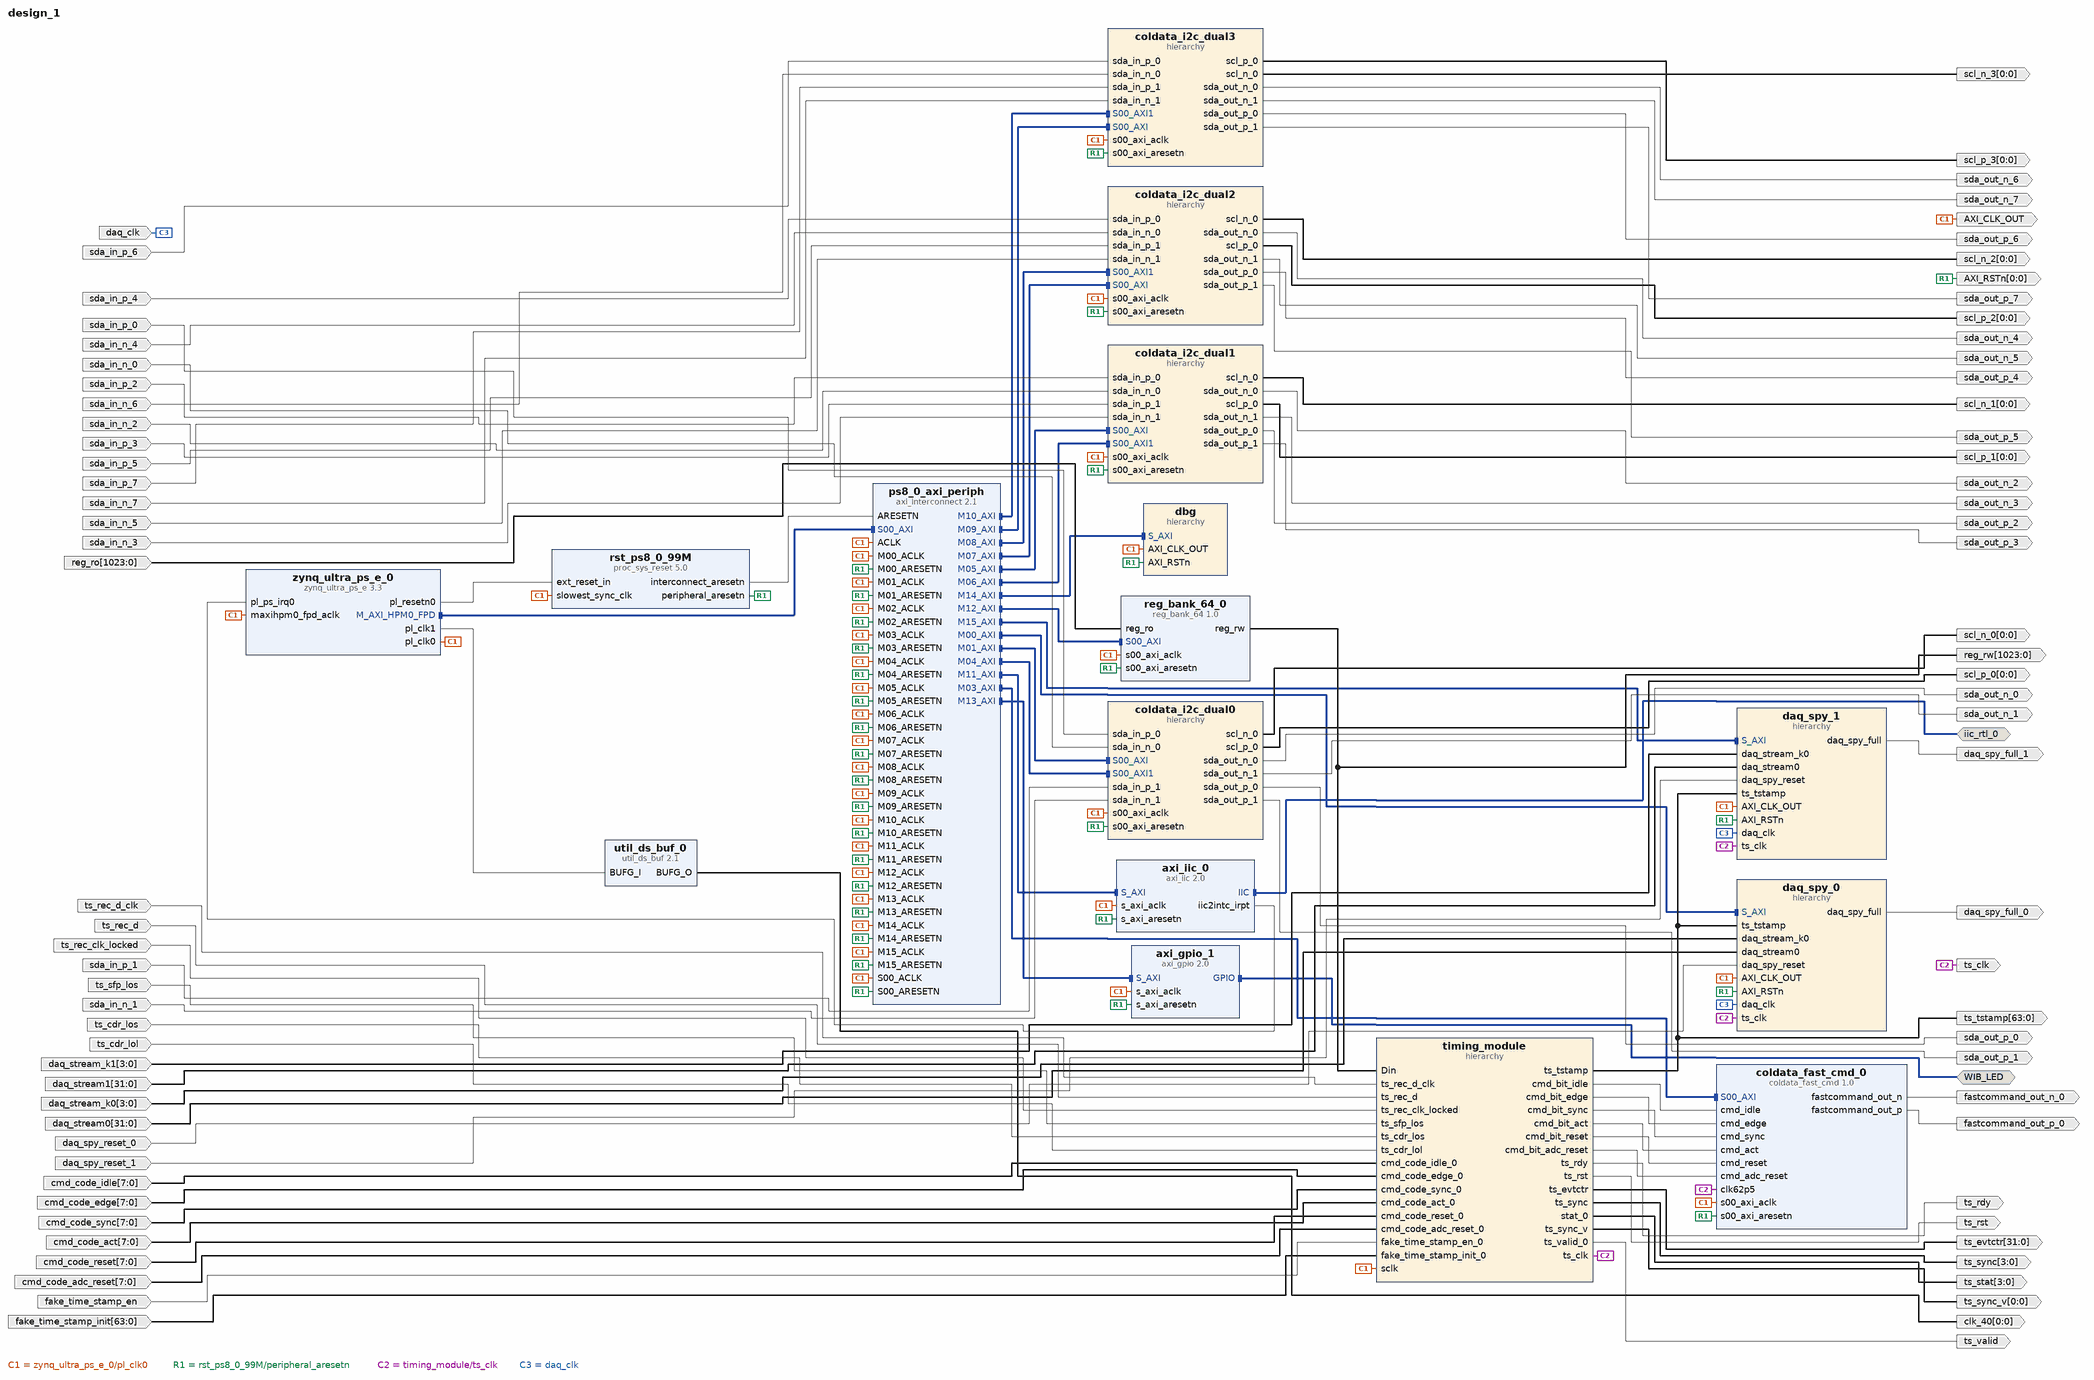
[diagram p0: block diagram of the top level]
# Vivado block design design_1, xczu9cg-ffvb1156-1-e, Vivado 2020.1.1_AR73018
create_bd_design design_1

create_bd_intf_port -mode Master -vlnv xilinx.com:interface:iic_rtl:1.0 iic_rtl_0
create_bd_intf_port -mode Master -vlnv xilinx.com:interface:gpio_rtl:1.0 WIB_LED
create_bd_port -dir O -from 0 -to 0 scl_p_0
create_bd_port -dir O -from 0 -to 0 scl_n_0
create_bd_port -dir O sda_out_p_0
create_bd_port -dir O sda_out_n_0
create_bd_port -dir I sda_in_p_0
create_bd_port -dir I sda_in_n_0
create_bd_port -dir O fastcommand_out_p_0
create_bd_port -dir O fastcommand_out_n_0
create_bd_port -dir I -type clk ts_rec_d_clk
set_property -dict {CONFIG.ASSOCIATED_RESET daq_spy_reset_0 CONFIG.FREQ_HZ 250000000} [get_bd_ports ts_rec_d_clk]
create_bd_port -dir I ts_rec_d
create_bd_port -dir I ts_rec_clk_locked
create_bd_port -dir I ts_sfp_los
create_bd_port -dir I ts_cdr_los
create_bd_port -dir I ts_cdr_lol
create_bd_port -dir O -type clk ts_clk
create_bd_port -dir O -type rst ts_rst
create_bd_port -dir O ts_rdy
create_bd_port -dir O -from 3 -to 0 ts_sync
create_bd_port -dir O -from 0 -to 0 ts_sync_v
create_bd_port -dir O -from 63 -to 0 ts_tstamp
create_bd_port -dir O -from 31 -to 0 ts_evtctr
create_bd_port -dir O sda_out_p_1
create_bd_port -dir O sda_out_n_1
create_bd_port -dir I sda_in_p_1
create_bd_port -dir I sda_in_n_1
create_bd_port -dir O sda_out_p_2
create_bd_port -dir O sda_out_n_2
create_bd_port -dir O sda_out_p_3
create_bd_port -dir O sda_out_n_3
create_bd_port -dir O sda_out_p_4
create_bd_port -dir O sda_out_n_4
create_bd_port -dir O sda_out_p_5
create_bd_port -dir O sda_out_n_5
create_bd_port -dir O sda_out_p_6
create_bd_port -dir O sda_out_n_6
create_bd_port -dir O sda_out_p_7
create_bd_port -dir O sda_out_n_7
create_bd_port -dir O -from 0 -to 0 scl_n_1
create_bd_port -dir O -from 0 -to 0 scl_p_1
create_bd_port -dir O -from 0 -to 0 scl_n_2
create_bd_port -dir O -from 0 -to 0 scl_p_2
create_bd_port -dir O -from 0 -to 0 scl_n_3
create_bd_port -dir O -from 0 -to 0 scl_p_3
create_bd_port -dir I sda_in_p_2
create_bd_port -dir I sda_in_n_2
create_bd_port -dir I sda_in_p_3
create_bd_port -dir I sda_in_n_3
create_bd_port -dir I sda_in_p_4
create_bd_port -dir I sda_in_n_4
create_bd_port -dir I sda_in_p_5
create_bd_port -dir I sda_in_n_5
create_bd_port -dir I sda_in_p_6
create_bd_port -dir I sda_in_n_6
create_bd_port -dir I sda_in_p_7
create_bd_port -dir I sda_in_n_7
create_bd_port -dir O -type clk AXI_CLK_OUT
create_bd_port -dir O -from 0 -to 0 -type rst AXI_RSTn
create_bd_port -dir I -from 1023 -to 0 reg_ro
create_bd_port -dir O -from 1023 -to 0 reg_rw
create_bd_port -dir I -from 3 -to 0 daq_stream_k1
create_bd_port -dir I -from 31 -to 0 daq_stream1
create_bd_port -dir I -from 3 -to 0 daq_stream_k0
create_bd_port -dir I -from 31 -to 0 daq_stream0
create_bd_port -dir I -type clk daq_clk
set_property -dict {CONFIG.ASSOCIATED_RESET daq_spy_reset_0:daq_spy_reset_1} [get_bd_ports daq_clk]
create_bd_port -dir I -type rst daq_spy_reset_0
set_property -dict {CONFIG.POLARITY ACTIVE_LOW} [get_bd_ports daq_spy_reset_0]
create_bd_port -dir O daq_spy_full_0
create_bd_port -dir I -type rst daq_spy_reset_1
create_bd_port -dir O daq_spy_full_1
create_bd_port -dir O -from 3 -to 0 ts_stat
create_bd_port -dir O ts_valid
create_bd_port -dir I -from 7 -to 0 cmd_code_idle
create_bd_port -dir I -from 7 -to 0 cmd_code_edge
create_bd_port -dir I -from 7 -to 0 cmd_code_sync
create_bd_port -dir I -from 7 -to 0 cmd_code_act
create_bd_port -dir I -from 7 -to 0 -type rst cmd_code_reset
create_bd_port -dir I -from 7 -to 0 -type rst cmd_code_adc_reset
create_bd_port -dir I fake_time_stamp_en
create_bd_port -dir I -from 63 -to 0 fake_time_stamp_init
create_bd_port -dir O -from 0 -to 0 -type clk clk_40
set_property -dict {CONFIG.FREQ_HZ 40000000} [get_bd_ports clk_40]

create_bd_cell -type hier timing_module
create_bd_cell -type hier coldata_i2c_dual0
create_bd_cell -type hier coldata_i2c_dual1
create_bd_cell -type hier coldata_i2c_dual2
create_bd_cell -type hier coldata_i2c_dual3
create_bd_cell -type hier dbg
create_bd_cell -type hier daq_spy_0
create_bd_cell -type hier daq_spy_1
create_bd_cell -type ip -vlnv xilinx.com:ip:axi_gpio:2.0 axi_gpio_1
set_property -dict [list \
  CONFIG.C_ALL_INPUTS 0 \
  CONFIG.C_ALL_OUTPUTS 1 \
  CONFIG.C_DOUT_DEFAULT 0x0000005a \
  CONFIG.GPIO_BOARD_INTERFACE Custom \
  CONFIG.USE_BOARD_FLOW true \
] [get_bd_cells axi_gpio_1]
create_bd_cell -type ip -vlnv xilinx.com:ip:axi_iic:2.0 axi_iic_0
set_property -dict {CONFIG.IIC_BOARD_INTERFACE Custom CONFIG.USE_BOARD_FLOW true} [get_bd_cells axi_iic_0]
create_bd_cell -type ip -vlnv user.org:user:coldata_fast_cmd:1.0 coldata_fast_cmd_0
create_bd_cell -type ip -vlnv xilinx.com:ip:axi_interconnect:2.1 ps8_0_axi_periph
set_property -dict {CONFIG.NUM_MI 16} [get_bd_cells ps8_0_axi_periph]
create_bd_cell -type ip -vlnv user.org:user:reg_bank_64:1.0 reg_bank_64_0
create_bd_cell -type ip -vlnv xilinx.com:ip:proc_sys_reset:5.0 rst_ps8_0_99M
create_bd_cell -type ip -vlnv xilinx.com:ip:zynq_ultra_ps_e:3.3 zynq_ultra_ps_e_0
set_property -dict [list \
  CONFIG.CAN0_BOARD_INTERFACE custom \
  CONFIG.CAN1_BOARD_INTERFACE custom \
  CONFIG.CSU_BOARD_INTERFACE custom \
  CONFIG.DP_BOARD_INTERFACE custom \
  CONFIG.GEM0_BOARD_INTERFACE custom \
  CONFIG.GEM1_BOARD_INTERFACE custom \
  CONFIG.GEM2_BOARD_INTERFACE custom \
  CONFIG.GEM3_BOARD_INTERFACE custom \
  CONFIG.GPIO_BOARD_INTERFACE custom \
  CONFIG.IIC0_BOARD_INTERFACE custom \
  CONFIG.IIC1_BOARD_INTERFACE custom \
  CONFIG.NAND_BOARD_INTERFACE custom \
  CONFIG.PCIE_BOARD_INTERFACE custom \
  CONFIG.PJTAG_BOARD_INTERFACE custom \
  CONFIG.PMU_BOARD_INTERFACE custom \
  CONFIG.PSU_BANK_0_IO_STANDARD LVCMOS18 \
  CONFIG.PSU_BANK_1_IO_STANDARD LVCMOS18 \
  CONFIG.PSU_BANK_2_IO_STANDARD LVCMOS18 \
  CONFIG.PSU_BANK_3_IO_STANDARD LVCMOS18 \
  CONFIG.PSU_DYNAMIC_DDR_CONFIG_EN 1 \
  CONFIG.PSU_USB3__DUAL_CLOCK_ENABLE 0 \
  CONFIG.PSU__ACPU2__POWER__ON 0 \
  CONFIG.PSU__ACPU3__POWER__ON 0 \
  CONFIG.PSU__CAN1__PERIPHERAL__ENABLE 1 \
  CONFIG.PSU__CAN1__PERIPHERAL__IO {MIO 24 .. 25} \
  CONFIG.PSU__CRF_APB__ACPU_CTRL__FREQMHZ 1200 \
  CONFIG.PSU__CRF_APB__ACPU_CTRL__SRCSEL APLL \
  CONFIG.PSU__CRF_APB__APLL_CTRL__SRCSEL PSS_REF_CLK \
  CONFIG.PSU__CRF_APB__DBG_FPD_CTRL__FREQMHZ 250 \
  CONFIG.PSU__CRF_APB__DBG_FPD_CTRL__SRCSEL IOPLL \
  CONFIG.PSU__CRF_APB__DBG_TRACE_CTRL__FREQMHZ 250 \
  CONFIG.PSU__CRF_APB__DBG_TRACE_CTRL__SRCSEL IOPLL \
  CONFIG.PSU__CRF_APB__DBG_TSTMP_CTRL__FREQMHZ 250 \
  CONFIG.PSU__CRF_APB__DBG_TSTMP_CTRL__SRCSEL IOPLL \
  CONFIG.PSU__CRF_APB__DDR_CTRL__FREQMHZ 1067 \
  CONFIG.PSU__CRF_APB__DDR_CTRL__SRCSEL DPLL \
  CONFIG.PSU__CRF_APB__DPDMA_REF_CTRL__FREQMHZ 600 \
  CONFIG.PSU__CRF_APB__DPDMA_REF_CTRL__SRCSEL APLL \
  CONFIG.PSU__CRF_APB__DPLL_CTRL__SRCSEL PSS_REF_CLK \
  CONFIG.PSU__CRF_APB__DP_AUDIO_REF_CTRL__SRCSEL RPLL \
  CONFIG.PSU__CRF_APB__DP_STC_REF_CTRL__SRCSEL RPLL \
  CONFIG.PSU__CRF_APB__DP_VIDEO_REF_CTRL__SRCSEL VPLL \
  CONFIG.PSU__CRF_APB__GDMA_REF_CTRL__FREQMHZ 600 \
  CONFIG.PSU__CRF_APB__GDMA_REF_CTRL__SRCSEL APLL \
  CONFIG.PSU__CRF_APB__GPU_REF_CTRL__FREQMHZ 500 \
  CONFIG.PSU__CRF_APB__GPU_REF_CTRL__SRCSEL IOPLL \
  CONFIG.PSU__CRF_APB__TOPSW_LSBUS_CTRL__FREQMHZ 100 \
  CONFIG.PSU__CRF_APB__TOPSW_LSBUS_CTRL__SRCSEL IOPLL \
  CONFIG.PSU__CRF_APB__TOPSW_MAIN_CTRL__FREQMHZ 533.33 \
  CONFIG.PSU__CRF_APB__TOPSW_MAIN_CTRL__SRCSEL DPLL \
  CONFIG.PSU__CRF_APB__VPLL_CTRL__SRCSEL PSS_REF_CLK \
  CONFIG.PSU__CRL_APB__ADMA_REF_CTRL__FREQMHZ 500 \
  CONFIG.PSU__CRL_APB__ADMA_REF_CTRL__SRCSEL IOPLL \
  CONFIG.PSU__CRL_APB__CAN1_REF_CTRL__FREQMHZ 100 \
  CONFIG.PSU__CRL_APB__CAN1_REF_CTRL__SRCSEL IOPLL \
  CONFIG.PSU__CRL_APB__CPU_R5_CTRL__FREQMHZ 500 \
  CONFIG.PSU__CRL_APB__CPU_R5_CTRL__SRCSEL IOPLL \
  CONFIG.PSU__CRL_APB__DBG_LPD_CTRL__FREQMHZ 250 \
  CONFIG.PSU__CRL_APB__DBG_LPD_CTRL__SRCSEL IOPLL \
  CONFIG.PSU__CRL_APB__GEM3_REF_CTRL__FREQMHZ 125 \
  CONFIG.PSU__CRL_APB__GEM3_REF_CTRL__SRCSEL IOPLL \
  CONFIG.PSU__CRL_APB__I2C0_REF_CTRL__FREQMHZ 100 \
  CONFIG.PSU__CRL_APB__I2C0_REF_CTRL__SRCSEL IOPLL \
  CONFIG.PSU__CRL_APB__I2C1_REF_CTRL__FREQMHZ 100 \
  CONFIG.PSU__CRL_APB__I2C1_REF_CTRL__SRCSEL IOPLL \
  CONFIG.PSU__CRL_APB__IOPLL_CTRL__SRCSEL PSS_REF_CLK \
  CONFIG.PSU__CRL_APB__IOU_SWITCH_CTRL__FREQMHZ 250 \
  CONFIG.PSU__CRL_APB__IOU_SWITCH_CTRL__SRCSEL IOPLL \
  CONFIG.PSU__CRL_APB__LPD_LSBUS_CTRL__FREQMHZ 100 \
  CONFIG.PSU__CRL_APB__LPD_LSBUS_CTRL__SRCSEL IOPLL \
  CONFIG.PSU__CRL_APB__LPD_SWITCH_CTRL__FREQMHZ 500 \
  CONFIG.PSU__CRL_APB__LPD_SWITCH_CTRL__SRCSEL IOPLL \
  CONFIG.PSU__CRL_APB__PCAP_CTRL__FREQMHZ 200 \
  CONFIG.PSU__CRL_APB__PCAP_CTRL__SRCSEL IOPLL \
  CONFIG.PSU__CRL_APB__PL0_REF_CTRL__FREQMHZ 100 \
  CONFIG.PSU__CRL_APB__PL0_REF_CTRL__SRCSEL IOPLL \
  CONFIG.PSU__CRL_APB__PL1_REF_CTRL__FREQMHZ 40 \
  CONFIG.PSU__CRL_APB__QSPI_REF_CTRL__FREQMHZ 125 \
  CONFIG.PSU__CRL_APB__QSPI_REF_CTRL__SRCSEL IOPLL \
  CONFIG.PSU__CRL_APB__RPLL_CTRL__SRCSEL PSS_REF_CLK \
  CONFIG.PSU__CRL_APB__SDIO1_REF_CTRL__FREQMHZ 200 \
  CONFIG.PSU__CRL_APB__SDIO1_REF_CTRL__SRCSEL IOPLL \
  CONFIG.PSU__CRL_APB__TIMESTAMP_REF_CTRL__FREQMHZ 100 \
  CONFIG.PSU__CRL_APB__TIMESTAMP_REF_CTRL__SRCSEL IOPLL \
  CONFIG.PSU__CRL_APB__UART0_REF_CTRL__FREQMHZ 100 \
  CONFIG.PSU__CRL_APB__UART0_REF_CTRL__SRCSEL IOPLL \
  CONFIG.PSU__CRL_APB__UART1_REF_CTRL__FREQMHZ 100 \
  CONFIG.PSU__CRL_APB__UART1_REF_CTRL__SRCSEL IOPLL \
  CONFIG.PSU__CRL_APB__USB0_BUS_REF_CTRL__FREQMHZ 250 \
  CONFIG.PSU__CRL_APB__USB0_BUS_REF_CTRL__SRCSEL IOPLL \
  CONFIG.PSU__CRL_APB__USB3_DUAL_REF_CTRL__FREQMHZ 20 \
  CONFIG.PSU__CRL_APB__USB3_DUAL_REF_CTRL__SRCSEL IOPLL \
  CONFIG.PSU__CRL_APB__USB3__ENABLE 0 \
  CONFIG.PSU__CSUPMU__PERIPHERAL__VALID 0 \
  CONFIG.PSU__DDRC__BUS_WIDTH {64 Bit} \
  CONFIG.PSU__DDRC__COMPONENTS UDIMM \
  CONFIG.PSU__DDRC__DEVICE_CAPACITY {8192 MBits} \
  CONFIG.PSU__DDRC__DRAM_WIDTH {16 Bits} \
  CONFIG.PSU__DDRC__ECC Disabled \
  CONFIG.PSU__DDRC__MEMORY_TYPE {DDR 4} \
  CONFIG.PSU__DDRC__SPEED_BIN DDR4_2133P \
  CONFIG.PSU__DDR_HIGH_ADDRESS_GUI_ENABLE 1 \
  CONFIG.PSU__DDR__INTERFACE__FREQMHZ 533.500 \
  CONFIG.PSU__DEVICE_TYPE CG \
  CONFIG.PSU__DISPLAYPORT__PERIPHERAL__ENABLE 0 \
  CONFIG.PSU__DLL__ISUSED 1 \
  CONFIG.PSU__ENET0__PERIPHERAL__ENABLE 1 \
  CONFIG.PSU__ENET0__PERIPHERAL__IO {GT Lane0} \
  CONFIG.PSU__ENET3__PERIPHERAL__ENABLE 0 \
  CONFIG.PSU__FPD_SLCR__WDT1__FREQMHZ 100 \
  CONFIG.PSU__FPGA_PL0_ENABLE 1 \
  CONFIG.PSU__FPGA_PL1_ENABLE 1 \
  CONFIG.PSU__GEM0__REF_CLK_FREQ 125 \
  CONFIG.PSU__GEM0__REF_CLK_SEL {Ref Clk0} \
  CONFIG.PSU__GEM__TSU__ENABLE 0 \
  CONFIG.PSU__GPIO0_MIO__PERIPHERAL__ENABLE 0 \
  CONFIG.PSU__GPIO1_MIO__PERIPHERAL__ENABLE 0 \
  CONFIG.PSU__GPU_PP0__POWER__ON 0 \
  CONFIG.PSU__GPU_PP1__POWER__ON 0 \
  CONFIG.PSU__I2C0__PERIPHERAL__ENABLE 1 \
  CONFIG.PSU__I2C0__PERIPHERAL__IO {MIO 14 .. 15} \
  CONFIG.PSU__I2C1__PERIPHERAL__ENABLE 1 \
  CONFIG.PSU__I2C1__PERIPHERAL__IO {MIO 16 .. 17} \
  CONFIG.PSU__IOU_SLCR__IOU_TTC_APB_CLK__TTC0_SEL APB \
  CONFIG.PSU__IOU_SLCR__IOU_TTC_APB_CLK__TTC1_SEL APB \
  CONFIG.PSU__IOU_SLCR__IOU_TTC_APB_CLK__TTC2_SEL APB \
  CONFIG.PSU__IOU_SLCR__IOU_TTC_APB_CLK__TTC3_SEL APB \
  CONFIG.PSU__IOU_SLCR__TTC0__FREQMHZ 100 \
  CONFIG.PSU__IOU_SLCR__TTC1__FREQMHZ 100 \
  CONFIG.PSU__IOU_SLCR__TTC2__FREQMHZ 100 \
  CONFIG.PSU__IOU_SLCR__TTC3__FREQMHZ 100 \
  CONFIG.PSU__IOU_SLCR__WDT0__FREQMHZ 100 \
  CONFIG.PSU__LPD_SLCR__CSUPMU__FREQMHZ 100 \
  CONFIG.PSU__MAXIGP0__DATA_WIDTH 128 \
  CONFIG.PSU__OVERRIDE_HPX_QOS 0 \
  CONFIG.PSU__OVERRIDE__BASIC_CLOCK 0 \
  CONFIG.PSU__PCIE__CLASS_CODE_BASE 0x06 \
  CONFIG.PSU__PCIE__CLASS_CODE_INTERFACE 0x0 \
  CONFIG.PSU__PCIE__CLASS_CODE_SUB 0x4 \
  CONFIG.PSU__PCIE__DEVICE_ID 0xD021 \
  CONFIG.PSU__PCIE__REVISION_ID 0x0 \
  CONFIG.PSU__PCIE__SUBSYSTEM_ID 0x7 \
  CONFIG.PSU__PCIE__SUBSYSTEM_VENDOR_ID 0x10EE \
  CONFIG.PSU__PCIE__VENDOR_ID 0x10EE \
  CONFIG.PSU__PMU__GPO2__POLARITY low \
  CONFIG.PSU__PMU__GPO3__POLARITY low \
  CONFIG.PSU__PMU__GPO4__POLARITY low \
  CONFIG.PSU__PMU__GPO5__POLARITY low \
  CONFIG.PSU__PMU__PERIPHERAL__ENABLE 0 \
  CONFIG.PSU__PRESET_APPLIED 1 \
  CONFIG.PSU__PSS_REF_CLK__FREQMHZ 33.333333 \
  CONFIG.PSU__QSPI_COHERENCY 0 \
  CONFIG.PSU__QSPI_ROUTE_THROUGH_FPD 0 \
  CONFIG.PSU__QSPI__GRP_FBCLK__ENABLE 0 \
  CONFIG.PSU__QSPI__PERIPHERAL__DATA_MODE x4 \
  CONFIG.PSU__QSPI__PERIPHERAL__ENABLE 1 \
  CONFIG.PSU__QSPI__PERIPHERAL__IO {MIO 0 .. 12} \
  CONFIG.PSU__QSPI__PERIPHERAL__MODE {Dual Parallel} \
  CONFIG.PSU__SATA__PERIPHERAL__ENABLE 0 \
  CONFIG.PSU__SD1_COHERENCY 0 \
  CONFIG.PSU__SD1_ROUTE_THROUGH_FPD 0 \
  CONFIG.PSU__SD1__DATA_TRANSFER_MODE 4Bit \
  CONFIG.PSU__SD1__GRP_CD__ENABLE 1 \
  CONFIG.PSU__SD1__GRP_CD__IO {MIO 45} \
  CONFIG.PSU__SD1__GRP_POW__ENABLE 0 \
  CONFIG.PSU__SD1__GRP_WP__ENABLE 0 \
  CONFIG.PSU__SD1__PERIPHERAL__ENABLE 1 \
  CONFIG.PSU__SD1__PERIPHERAL__IO {MIO 46 .. 51} \
  CONFIG.PSU__SD1__SLOT_TYPE {SD 2.0} \
  CONFIG.PSU__SWDT0__PERIPHERAL__ENABLE 0 \
  CONFIG.PSU__SWDT1__PERIPHERAL__ENABLE 0 \
  CONFIG.PSU__TSU__BUFG_PORT_PAIR 0 \
  CONFIG.PSU__TTC0__PERIPHERAL__ENABLE 0 \
  CONFIG.PSU__TTC1__PERIPHERAL__ENABLE 0 \
  CONFIG.PSU__TTC2__PERIPHERAL__ENABLE 0 \
  CONFIG.PSU__TTC3__PERIPHERAL__ENABLE 0 \
  CONFIG.PSU__UART0__BAUD_RATE 115200 \
  CONFIG.PSU__UART0__MODEM__ENABLE 0 \
  CONFIG.PSU__UART0__PERIPHERAL__ENABLE 1 \
  CONFIG.PSU__UART0__PERIPHERAL__IO {MIO 18 .. 19} \
  CONFIG.PSU__UART1__PERIPHERAL__ENABLE 0 \
  CONFIG.PSU__USB0__PERIPHERAL__ENABLE 0 \
  CONFIG.PSU__USE__IRQ0 1 \
  CONFIG.PSU__USE__M_AXI_GP0 1 \
  CONFIG.PSU__USE__M_AXI_GP1 0 \
  CONFIG.PSU__USE__M_AXI_GP2 0 \
  CONFIG.QSPI_BOARD_INTERFACE custom \
  CONFIG.SATA_BOARD_INTERFACE custom \
  CONFIG.SD0_BOARD_INTERFACE custom \
  CONFIG.SD1_BOARD_INTERFACE custom \
  CONFIG.SPI0_BOARD_INTERFACE custom \
  CONFIG.SPI1_BOARD_INTERFACE custom \
  CONFIG.SUBPRESET1 Custom \
  CONFIG.SUBPRESET2 Custom \
  CONFIG.SWDT0_BOARD_INTERFACE custom \
  CONFIG.SWDT1_BOARD_INTERFACE custom \
  CONFIG.TRACE_BOARD_INTERFACE custom \
  CONFIG.TTC0_BOARD_INTERFACE custom \
  CONFIG.TTC1_BOARD_INTERFACE custom \
  CONFIG.TTC2_BOARD_INTERFACE custom \
  CONFIG.TTC3_BOARD_INTERFACE custom \
  CONFIG.UART0_BOARD_INTERFACE custom \
  CONFIG.UART1_BOARD_INTERFACE custom \
  CONFIG.USB0_BOARD_INTERFACE custom \
  CONFIG.USB1_BOARD_INTERFACE custom \
] [get_bd_cells zynq_ultra_ps_e_0]
# 796 more settings of zynq_ultra_ps_e_0 are not shown: defaults, MIO pin electricals, DDR timing, and values the tool derives
create_bd_cell -type ip -vlnv xilinx.com:ip:util_ds_buf:2.1 util_ds_buf_0
set_property -dict {CONFIG.C_BUF_TYPE BUFG} [get_bd_cells util_ds_buf_0]

# ---- hierarchy /timing_module ----
current_bd_instance /timing_module
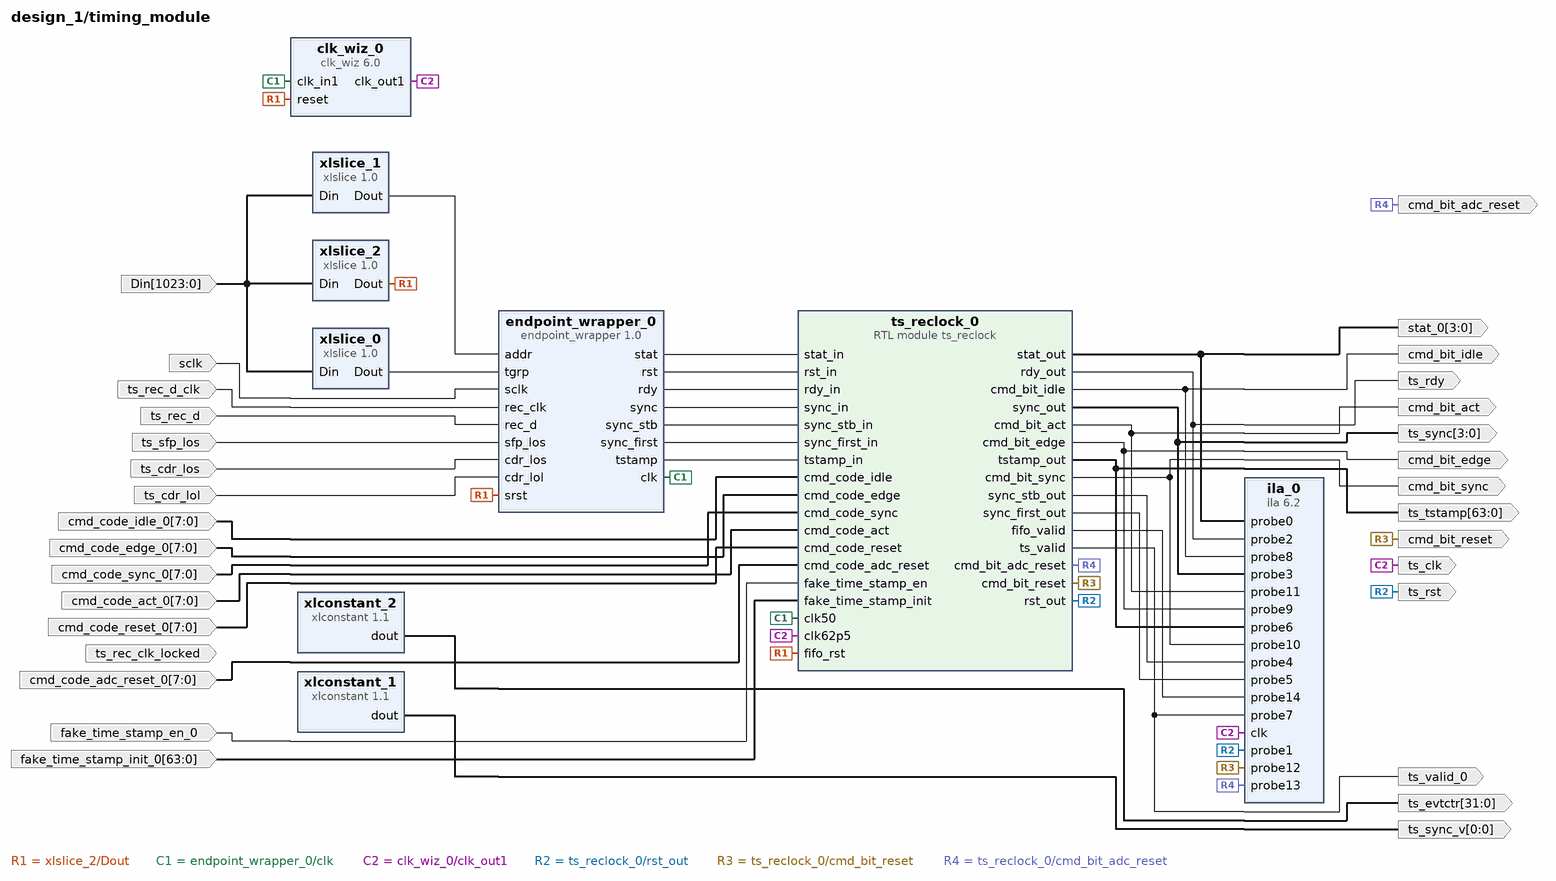
[diagram p1: block diagram inside /timing_module]
create_bd_pin -dir I sclk
create_bd_pin -dir I -type clk ts_rec_d_clk
create_bd_pin -dir I ts_rec_d
create_bd_pin -dir I ts_rec_clk_locked
create_bd_pin -dir I ts_sfp_los
create_bd_pin -dir I ts_cdr_los
create_bd_pin -dir I ts_cdr_lol
create_bd_pin -dir O -type clk ts_clk
create_bd_pin -dir O -type rst ts_rst
create_bd_pin -dir O ts_rdy
create_bd_pin -dir O -from 3 -to 0 ts_sync
create_bd_pin -dir O -from 0 -to 0 ts_sync_v
create_bd_pin -dir O -from 63 -to 0 ts_tstamp
create_bd_pin -dir O -from 31 -to 0 ts_evtctr
create_bd_pin -dir I -from 1023 -to 0 Din
create_bd_pin -dir O -from 3 -to 0 stat_0
create_bd_pin -dir O ts_valid_0
create_bd_pin -dir I -from 7 -to 0 cmd_code_idle_0
create_bd_pin -dir I -from 7 -to 0 cmd_code_edge_0
create_bd_pin -dir I -from 7 -to 0 cmd_code_sync_0
create_bd_pin -dir I -from 7 -to 0 cmd_code_act_0
create_bd_pin -dir I -from 7 -to 0 -type rst cmd_code_reset_0
create_bd_pin -dir I -from 7 -to 0 -type rst cmd_code_adc_reset_0
create_bd_pin -dir O cmd_bit_idle
create_bd_pin -dir O cmd_bit_edge
create_bd_pin -dir O cmd_bit_sync
create_bd_pin -dir O cmd_bit_act
create_bd_pin -dir O -type rst cmd_bit_reset
create_bd_pin -dir O -type rst cmd_bit_adc_reset
create_bd_pin -dir I fake_time_stamp_en_0
create_bd_pin -dir I -from 63 -to 0 fake_time_stamp_init_0

create_bd_cell -type module -reference ts_reclock ts_reclock_0
create_bd_cell -type ip -vlnv xilinx.com:ip:clk_wiz:6.0 clk_wiz_0
set_property -dict [list \
  CONFIG.CLKIN1_JITTER_PS 200.0 \
  CONFIG.CLKOUT1_JITTER 194.103 \
  CONFIG.CLKOUT1_PHASE_ERROR 221.516 \
  CONFIG.CLKOUT1_REQUESTED_OUT_FREQ 62.5 \
  CONFIG.MMCM_CLKFBOUT_MULT_F 48.125 \
  CONFIG.MMCM_CLKIN1_PERIOD 20.000 \
  CONFIG.MMCM_CLKIN2_PERIOD 10.0 \
  CONFIG.MMCM_CLKOUT0_DIVIDE_F 19.250 \
  CONFIG.MMCM_DIVCLK_DIVIDE 2 \
  CONFIG.PRIM_IN_FREQ 50 \
] [get_bd_cells clk_wiz_0]
create_bd_cell -type ip -vlnv user.org:user:endpoint_wrapper:1.0 endpoint_wrapper_0
create_bd_cell -type ip -vlnv xilinx.com:ip:ila:6.2 ila_0
set_property -dict [list \
  CONFIG.C_ENABLE_ILA_AXI_MON false \
  CONFIG.C_MONITOR_TYPE Native \
  CONFIG.C_NUM_OF_PROBES 15 \
  CONFIG.C_PROBE0_WIDTH 4 \
  CONFIG.C_PROBE3_WIDTH 4 \
  CONFIG.C_PROBE6_WIDTH 64 \
] [get_bd_cells ila_0]
create_bd_cell -type ip -vlnv xilinx.com:ip:xlconstant:1.1 xlconstant_1
set_property -dict {CONFIG.CONST_VAL 0} [get_bd_cells xlconstant_1]
create_bd_cell -type ip -vlnv xilinx.com:ip:xlconstant:1.1 xlconstant_2
set_property -dict {CONFIG.CONST_VAL 0 CONFIG.CONST_WIDTH 32} [get_bd_cells xlconstant_2]
create_bd_cell -type ip -vlnv xilinx.com:ip:xlslice:1.0 xlslice_0
set_property -dict {CONFIG.DIN_FROM 9 CONFIG.DIN_TO 8 CONFIG.DIN_WIDTH 1024 CONFIG.DOUT_WIDTH 2} [get_bd_cells xlslice_0]
create_bd_cell -type ip -vlnv xilinx.com:ip:xlslice:1.0 xlslice_2
set_property -dict {CONFIG.DIN_FROM 28 CONFIG.DIN_TO 28 CONFIG.DIN_WIDTH 1024 CONFIG.DOUT_WIDTH 1} [get_bd_cells xlslice_2]
create_bd_cell -type ip -vlnv xilinx.com:ip:xlslice:1.0 xlslice_1
set_property -dict {CONFIG.DIN_FROM 7 CONFIG.DIN_WIDTH 1024 CONFIG.DOUT_WIDTH 8} [get_bd_cells xlslice_1]

# ---- hierarchy /coldata_i2c_dual0 ----
current_bd_instance /coldata_i2c_dual0
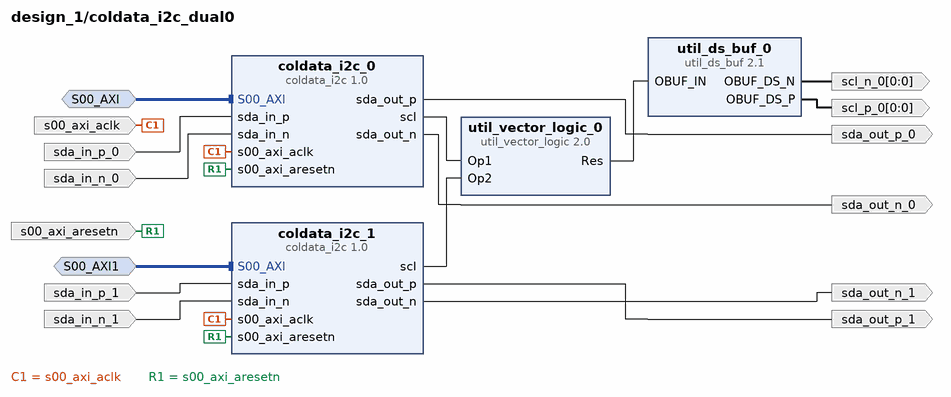
[diagram p2: block diagram inside /coldata_i2c_dual0]
create_bd_intf_pin -mode Slave -vlnv xilinx.com:interface:aximm_rtl:1.0 S00_AXI
create_bd_intf_pin -mode Slave -vlnv xilinx.com:interface:aximm_rtl:1.0 S00_AXI1
create_bd_pin -dir O sda_out_p_0
create_bd_pin -dir O sda_out_n_0
create_bd_pin -dir I sda_in_p_0
create_bd_pin -dir I sda_in_n_0
create_bd_pin -dir I -type clk s00_axi_aclk
create_bd_pin -dir I -type rst s00_axi_aresetn
create_bd_pin -dir O -from 0 -to 0 -type clk scl_p_0
create_bd_pin -dir O -from 0 -to 0 -type clk scl_n_0
create_bd_pin -dir O sda_out_p_1
create_bd_pin -dir O sda_out_n_1
create_bd_pin -dir I sda_in_p_1
create_bd_pin -dir I sda_in_n_1

create_bd_cell -type ip -vlnv user.org:user:coldata_i2c:1.0 coldata_i2c_0
set_property -dict {CONFIG.bit_duration 180 CONFIG.scl_down 130 CONFIG.scl_up 40} [get_bd_cells coldata_i2c_0]
create_bd_cell -type ip -vlnv user.org:user:coldata_i2c:1.0 coldata_i2c_1
set_property -dict {CONFIG.bit_duration 180 CONFIG.scl_down 130 CONFIG.scl_up 40} [get_bd_cells coldata_i2c_1]
create_bd_cell -type ip -vlnv xilinx.com:ip:util_ds_buf:2.1 util_ds_buf_0
set_property -dict {CONFIG.C_BUF_TYPE OBUFDS} [get_bd_cells util_ds_buf_0]
create_bd_cell -type ip -vlnv xilinx.com:ip:util_vector_logic:2.0 util_vector_logic_0
set_property -dict {CONFIG.C_SIZE 1} [get_bd_cells util_vector_logic_0]

# ---- hierarchy /coldata_i2c_dual1 ----
current_bd_instance /coldata_i2c_dual1
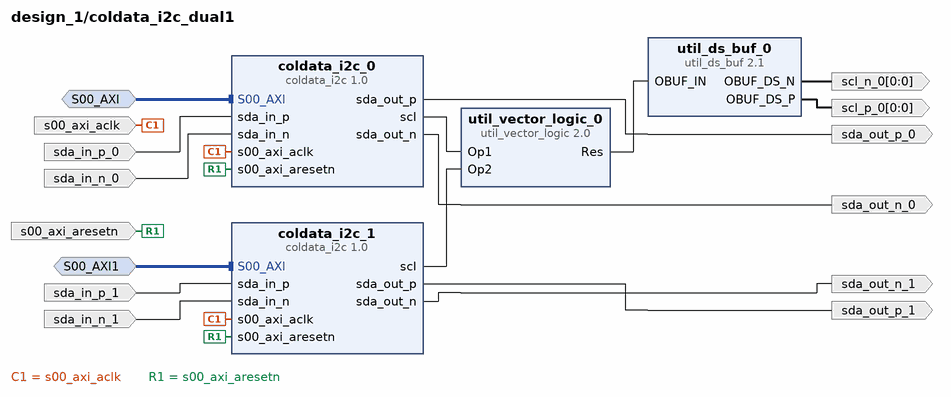
[diagram p3: block diagram inside /coldata_i2c_dual1]
create_bd_intf_pin -mode Slave -vlnv xilinx.com:interface:aximm_rtl:1.0 S00_AXI
create_bd_intf_pin -mode Slave -vlnv xilinx.com:interface:aximm_rtl:1.0 S00_AXI1
create_bd_pin -dir O sda_out_p_0
create_bd_pin -dir O sda_out_n_0
create_bd_pin -dir I sda_in_p_0
create_bd_pin -dir I sda_in_n_0
create_bd_pin -dir I -type clk s00_axi_aclk
create_bd_pin -dir I -type rst s00_axi_aresetn
create_bd_pin -dir O -from 0 -to 0 -type clk scl_p_0
create_bd_pin -dir O -from 0 -to 0 -type clk scl_n_0
create_bd_pin -dir O sda_out_p_1
create_bd_pin -dir O sda_out_n_1
create_bd_pin -dir I sda_in_p_1
create_bd_pin -dir I sda_in_n_1

create_bd_cell -type ip -vlnv user.org:user:coldata_i2c:1.0 coldata_i2c_0
set_property -dict {CONFIG.bit_duration 180 CONFIG.scl_down 130 CONFIG.scl_up 40} [get_bd_cells coldata_i2c_0]
create_bd_cell -type ip -vlnv user.org:user:coldata_i2c:1.0 coldata_i2c_1
set_property -dict {CONFIG.bit_duration 180 CONFIG.scl_down 130 CONFIG.scl_up 40} [get_bd_cells coldata_i2c_1]
create_bd_cell -type ip -vlnv xilinx.com:ip:util_ds_buf:2.1 util_ds_buf_0
set_property -dict {CONFIG.C_BUF_TYPE OBUFDS} [get_bd_cells util_ds_buf_0]
create_bd_cell -type ip -vlnv xilinx.com:ip:util_vector_logic:2.0 util_vector_logic_0
set_property -dict {CONFIG.C_SIZE 1} [get_bd_cells util_vector_logic_0]

# ---- hierarchy /coldata_i2c_dual2 ----
current_bd_instance /coldata_i2c_dual2
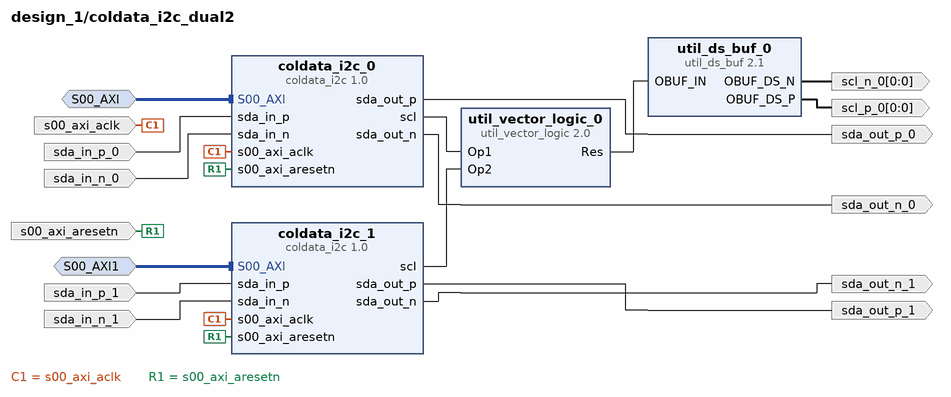
[diagram p4: block diagram inside /coldata_i2c_dual2]
create_bd_intf_pin -mode Slave -vlnv xilinx.com:interface:aximm_rtl:1.0 S00_AXI
create_bd_intf_pin -mode Slave -vlnv xilinx.com:interface:aximm_rtl:1.0 S00_AXI1
create_bd_pin -dir O sda_out_p_0
create_bd_pin -dir O sda_out_n_0
create_bd_pin -dir I sda_in_p_0
create_bd_pin -dir I sda_in_n_0
create_bd_pin -dir I -type clk s00_axi_aclk
create_bd_pin -dir I -type rst s00_axi_aresetn
create_bd_pin -dir O -from 0 -to 0 -type clk scl_p_0
create_bd_pin -dir O -from 0 -to 0 -type clk scl_n_0
create_bd_pin -dir O sda_out_p_1
create_bd_pin -dir O sda_out_n_1
create_bd_pin -dir I sda_in_p_1
create_bd_pin -dir I sda_in_n_1

create_bd_cell -type ip -vlnv user.org:user:coldata_i2c:1.0 coldata_i2c_0
set_property -dict {CONFIG.bit_duration 180 CONFIG.scl_down 130 CONFIG.scl_up 40} [get_bd_cells coldata_i2c_0]
create_bd_cell -type ip -vlnv user.org:user:coldata_i2c:1.0 coldata_i2c_1
set_property -dict {CONFIG.bit_duration 180 CONFIG.scl_down 130 CONFIG.scl_up 40} [get_bd_cells coldata_i2c_1]
create_bd_cell -type ip -vlnv xilinx.com:ip:util_ds_buf:2.1 util_ds_buf_0
set_property -dict {CONFIG.C_BUF_TYPE OBUFDS} [get_bd_cells util_ds_buf_0]
create_bd_cell -type ip -vlnv xilinx.com:ip:util_vector_logic:2.0 util_vector_logic_0
set_property -dict {CONFIG.C_SIZE 1} [get_bd_cells util_vector_logic_0]

# ---- hierarchy /coldata_i2c_dual3 ----
current_bd_instance /coldata_i2c_dual3
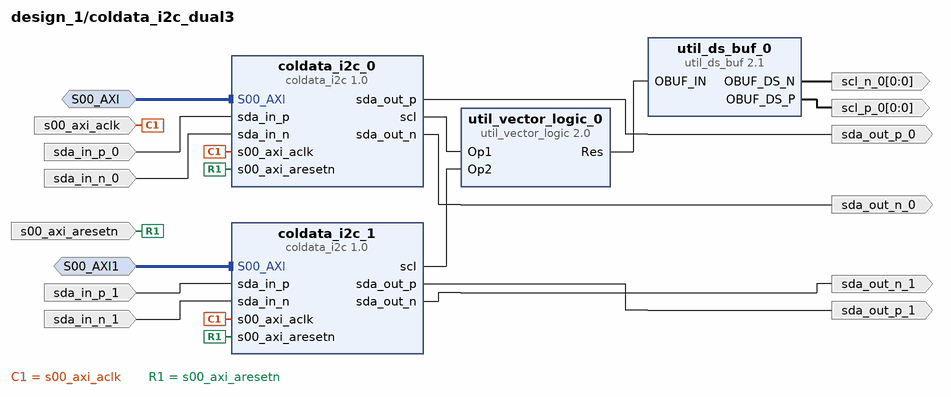
[diagram p5: block diagram inside /coldata_i2c_dual3]
create_bd_intf_pin -mode Slave -vlnv xilinx.com:interface:aximm_rtl:1.0 S00_AXI
create_bd_intf_pin -mode Slave -vlnv xilinx.com:interface:aximm_rtl:1.0 S00_AXI1
create_bd_pin -dir O sda_out_p_0
create_bd_pin -dir O sda_out_n_0
create_bd_pin -dir I sda_in_p_0
create_bd_pin -dir I sda_in_n_0
create_bd_pin -dir I -type clk s00_axi_aclk
create_bd_pin -dir I -type rst s00_axi_aresetn
create_bd_pin -dir O -from 0 -to 0 -type clk scl_p_0
create_bd_pin -dir O -from 0 -to 0 -type clk scl_n_0
create_bd_pin -dir O sda_out_p_1
create_bd_pin -dir O sda_out_n_1
create_bd_pin -dir I sda_in_p_1
create_bd_pin -dir I sda_in_n_1

create_bd_cell -type ip -vlnv user.org:user:coldata_i2c:1.0 coldata_i2c_0
set_property -dict {CONFIG.bit_duration 180 CONFIG.scl_down 130 CONFIG.scl_up 40} [get_bd_cells coldata_i2c_0]
create_bd_cell -type ip -vlnv user.org:user:coldata_i2c:1.0 coldata_i2c_1
set_property -dict {CONFIG.bit_duration 180 CONFIG.scl_down 130 CONFIG.scl_up 40} [get_bd_cells coldata_i2c_1]
create_bd_cell -type ip -vlnv xilinx.com:ip:util_ds_buf:2.1 util_ds_buf_0
set_property -dict {CONFIG.C_BUF_TYPE OBUFDS} [get_bd_cells util_ds_buf_0]
create_bd_cell -type ip -vlnv xilinx.com:ip:util_vector_logic:2.0 util_vector_logic_0
set_property -dict {CONFIG.C_SIZE 1} [get_bd_cells util_vector_logic_0]

# ---- hierarchy /dbg ----
current_bd_instance /dbg
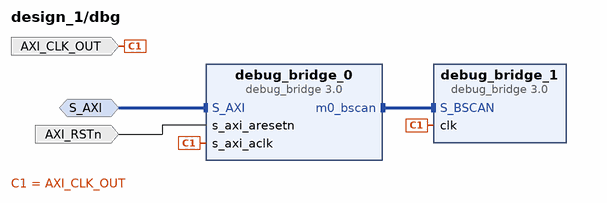
[diagram p6: block diagram inside /dbg]
create_bd_intf_pin -mode Slave -vlnv xilinx.com:interface:aximm_rtl:1.0 S_AXI
create_bd_pin -dir I -type clk AXI_CLK_OUT
create_bd_pin -dir I -type rst AXI_RSTn

create_bd_cell -type ip -vlnv xilinx.com:ip:debug_bridge:3.0 debug_bridge_0
set_property -dict {CONFIG.C_DEBUG_MODE 2 CONFIG.C_NUM_BS_MASTER 1} [get_bd_cells debug_bridge_0]
create_bd_cell -type ip -vlnv xilinx.com:ip:debug_bridge:3.0 debug_bridge_1

# ---- hierarchy /daq_spy_0 ----
current_bd_instance /daq_spy_0
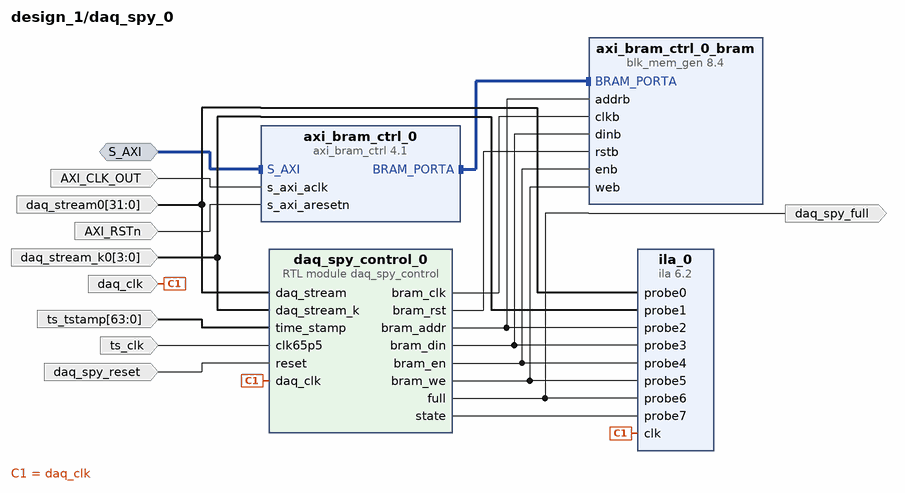
[diagram p7: block diagram inside /daq_spy_0]
create_bd_intf_pin -mode Slave -vlnv xilinx.com:interface:aximm_rtl:1.0 S_AXI
create_bd_pin -dir I -type clk AXI_CLK_OUT
create_bd_pin -dir I -type rst AXI_RSTn
create_bd_pin -dir I -from 31 -to 0 daq_stream0
create_bd_pin -dir I -from 3 -to 0 daq_stream_k0
create_bd_pin -dir I -type clk daq_clk
create_bd_pin -dir I -from 63 -to 0 ts_tstamp
create_bd_pin -dir I -type clk ts_clk
create_bd_pin -dir I -type rst daq_spy_reset
create_bd_pin -dir O daq_spy_full

create_bd_cell -type ip -vlnv xilinx.com:ip:axi_bram_ctrl:4.1 axi_bram_ctrl_0
set_property -dict {CONFIG.SINGLE_PORT_BRAM 1} [get_bd_cells axi_bram_ctrl_0]
create_bd_cell -type ip -vlnv xilinx.com:ip:blk_mem_gen:8.4 axi_bram_ctrl_0_bram
set_property -dict [list \
  CONFIG.Enable_B Use_ENB_Pin \
  CONFIG.Memory_Type True_Dual_Port_RAM \
  CONFIG.Port_B_Clock 100 \
  CONFIG.Port_B_Enable_Rate 100 \
  CONFIG.Port_B_Write_Rate 50 \
  CONFIG.Use_RSTB_Pin true \
] [get_bd_cells axi_bram_ctrl_0_bram]
create_bd_cell -type module -reference daq_spy_control daq_spy_control_0
create_bd_cell -type ip -vlnv xilinx.com:ip:ila:6.2 ila_0
set_property -dict [list \
  CONFIG.C_ENABLE_ILA_AXI_MON false \
  CONFIG.C_INPUT_PIPE_STAGES 6 \
  CONFIG.C_MONITOR_TYPE Native \
  CONFIG.C_NUM_OF_PROBES 8 \
] [get_bd_cells ila_0]

# ---- hierarchy /daq_spy_1 ----
current_bd_instance /daq_spy_1
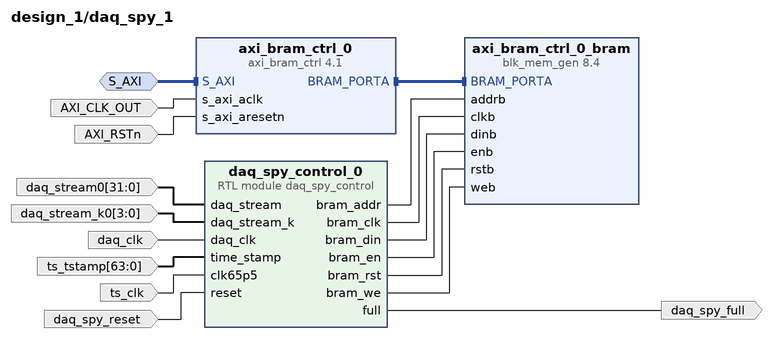
[diagram p8: block diagram inside /daq_spy_1]
create_bd_intf_pin -mode Slave -vlnv xilinx.com:interface:aximm_rtl:1.0 S_AXI
create_bd_pin -dir I -type clk AXI_CLK_OUT
create_bd_pin -dir I -type rst AXI_RSTn
create_bd_pin -dir I -from 31 -to 0 daq_stream0
create_bd_pin -dir I -from 3 -to 0 daq_stream_k0
create_bd_pin -dir I -type clk daq_clk
create_bd_pin -dir I -from 63 -to 0 ts_tstamp
create_bd_pin -dir I -type clk ts_clk
create_bd_pin -dir I -type rst daq_spy_reset
create_bd_pin -dir O daq_spy_full

create_bd_cell -type ip -vlnv xilinx.com:ip:axi_bram_ctrl:4.1 axi_bram_ctrl_0
set_property -dict {CONFIG.SINGLE_PORT_BRAM 1} [get_bd_cells axi_bram_ctrl_0]
create_bd_cell -type ip -vlnv xilinx.com:ip:blk_mem_gen:8.4 axi_bram_ctrl_0_bram
set_property -dict [list \
  CONFIG.Enable_B Use_ENB_Pin \
  CONFIG.Memory_Type True_Dual_Port_RAM \
  CONFIG.Port_B_Clock 100 \
  CONFIG.Port_B_Enable_Rate 100 \
  CONFIG.Port_B_Write_Rate 50 \
  CONFIG.Use_RSTB_Pin true \
] [get_bd_cells axi_bram_ctrl_0_bram]
create_bd_cell -type module -reference daq_spy_control daq_spy_control_0

# ---- connections ----

current_bd_instance /timing_module
connect_bd_net -net axi_gpio_1_gpio_io_o [get_bd_pins Din] [get_bd_pins xlslice_0/Din] [get_bd_pins xlslice_2/Din] [get_bd_pins xlslice_1/Din]
connect_bd_net [get_bd_pins xlconstant_2/dout] [get_bd_pins ts_evtctr]
connect_bd_net [get_bd_pins xlconstant_1/dout] [get_bd_pins ts_sync_v]
connect_bd_net [get_bd_pins xlslice_1/Dout] [get_bd_pins endpoint_wrapper_0/addr]
connect_bd_net [get_bd_pins xlslice_0/Dout] [get_bd_pins endpoint_wrapper_0/tgrp]
connect_bd_net [get_bd_pins sclk] [get_bd_pins endpoint_wrapper_0/sclk]
connect_bd_net [get_bd_pins ts_rec_d_clk] [get_bd_pins endpoint_wrapper_0/rec_clk]
connect_bd_net [get_bd_pins ts_rec_d] [get_bd_pins endpoint_wrapper_0/rec_d]
connect_bd_net [get_bd_pins ts_sfp_los] [get_bd_pins endpoint_wrapper_0/sfp_los]
connect_bd_net [get_bd_pins ts_cdr_los] [get_bd_pins endpoint_wrapper_0/cdr_los]
connect_bd_net [get_bd_pins ts_cdr_lol] [get_bd_pins endpoint_wrapper_0/cdr_lol]
connect_bd_net [get_bd_pins xlslice_2/Dout] [get_bd_pins ts_reclock_0/fifo_rst] [get_bd_pins clk_wiz_0/reset] [get_bd_pins endpoint_wrapper_0/srst]
connect_bd_net [get_bd_pins endpoint_wrapper_0/clk] [get_bd_pins ts_reclock_0/clk50] [get_bd_pins clk_wiz_0/clk_in1]
connect_bd_net [get_bd_pins clk_wiz_0/clk_out1] [get_bd_pins ts_clk] [get_bd_pins ts_reclock_0/clk62p5] [get_bd_pins ila_0/clk]
connect_bd_net [get_bd_pins endpoint_wrapper_0/stat] [get_bd_pins ts_reclock_0/stat_in]
connect_bd_net [get_bd_pins endpoint_wrapper_0/rst] [get_bd_pins ts_reclock_0/rst_in]
connect_bd_net [get_bd_pins endpoint_wrapper_0/rdy] [get_bd_pins ts_reclock_0/rdy_in]
connect_bd_net [get_bd_pins endpoint_wrapper_0/sync] [get_bd_pins ts_reclock_0/sync_in]
connect_bd_net [get_bd_pins endpoint_wrapper_0/sync_stb] [get_bd_pins ts_reclock_0/sync_stb_in]
connect_bd_net [get_bd_pins endpoint_wrapper_0/sync_first] [get_bd_pins ts_reclock_0/sync_first_in]
connect_bd_net [get_bd_pins endpoint_wrapper_0/tstamp] [get_bd_pins ts_reclock_0/tstamp_in]
connect_bd_net [get_bd_pins ts_reclock_0/stat_out] [get_bd_pins stat_0] [get_bd_pins ila_0/probe0]
connect_bd_net [get_bd_pins ts_reclock_0/rst_out] [get_bd_pins ts_rst] [get_bd_pins ila_0/probe1]
connect_bd_net [get_bd_pins ts_reclock_0/rdy_out] [get_bd_pins ts_rdy] [get_bd_pins ila_0/probe2]
connect_bd_net [get_bd_pins ts_reclock_0/sync_out] [get_bd_pins ts_sync] [get_bd_pins ila_0/probe3]
connect_bd_net [get_bd_pins ts_reclock_0/tstamp_out] [get_bd_pins ts_tstamp] [get_bd_pins ila_0/probe6]
connect_bd_net [get_bd_pins ts_reclock_0/ts_valid] [get_bd_pins ts_valid_0] [get_bd_pins ila_0/probe7]
connect_bd_net -net cmd_code_idle_0_1 [get_bd_pins cmd_code_idle_0] [get_bd_pins ts_reclock_0/cmd_code_idle]
connect_bd_net -net cmd_code_edge_0_1 [get_bd_pins cmd_code_edge_0] [get_bd_pins ts_reclock_0/cmd_code_edge]
connect_bd_net -net cmd_code_sync_0_1 [get_bd_pins cmd_code_sync_0] [get_bd_pins ts_reclock_0/cmd_code_sync]
connect_bd_net -net cmd_code_act_0_1 [get_bd_pins cmd_code_act_0] [get_bd_pins ts_reclock_0/cmd_code_act]
connect_bd_net -net cmd_code_reset_0_1 [get_bd_pins cmd_code_reset_0] [get_bd_pins ts_reclock_0/cmd_code_reset]
connect_bd_net -net cmd_code_adc_reset_0_1 [get_bd_pins cmd_code_adc_reset_0] [get_bd_pins ts_reclock_0/cmd_code_adc_reset]
connect_bd_net [get_bd_pins ts_reclock_0/cmd_bit_idle] [get_bd_pins cmd_bit_idle] [get_bd_pins ila_0/probe8]
connect_bd_net [get_bd_pins ts_reclock_0/cmd_bit_edge] [get_bd_pins cmd_bit_edge] [get_bd_pins ila_0/probe9]
connect_bd_net [get_bd_pins ts_reclock_0/cmd_bit_sync] [get_bd_pins cmd_bit_sync] [get_bd_pins ila_0/probe10]
connect_bd_net [get_bd_pins ts_reclock_0/cmd_bit_act] [get_bd_pins cmd_bit_act] [get_bd_pins ila_0/probe11]
connect_bd_net [get_bd_pins ts_reclock_0/cmd_bit_reset] [get_bd_pins cmd_bit_reset] [get_bd_pins ila_0/probe12]
connect_bd_net [get_bd_pins ts_reclock_0/cmd_bit_adc_reset] [get_bd_pins cmd_bit_adc_reset] [get_bd_pins ila_0/probe13]
connect_bd_net [get_bd_pins ts_reclock_0/sync_stb_out] [get_bd_pins ila_0/probe4]
connect_bd_net [get_bd_pins ts_reclock_0/sync_first_out] [get_bd_pins ila_0/probe5]
connect_bd_net [get_bd_pins ts_reclock_0/fifo_valid] [get_bd_pins ila_0/probe14]
connect_bd_net -net fake_time_stamp_en_0_1 [get_bd_pins fake_time_stamp_en_0] [get_bd_pins ts_reclock_0/fake_time_stamp_en]
connect_bd_net -net fake_time_stamp_init_0_1 [get_bd_pins fake_time_stamp_init_0] [get_bd_pins ts_reclock_0/fake_time_stamp_init]

current_bd_instance /coldata_i2c_dual0
connect_bd_intf_net [get_bd_intf_pins S00_AXI] [get_bd_intf_pins coldata_i2c_0/S00_AXI]
connect_bd_intf_net [get_bd_intf_pins S00_AXI1] [get_bd_intf_pins coldata_i2c_1/S00_AXI]
connect_bd_net [get_bd_pins coldata_i2c_0/sda_out_p] [get_bd_pins sda_out_p_0]
connect_bd_net [get_bd_pins coldata_i2c_0/sda_out_n] [get_bd_pins sda_out_n_0]
connect_bd_net -net sda_in_p_0_1 [get_bd_pins sda_in_p_0] [get_bd_pins coldata_i2c_0/sda_in_p]
connect_bd_net -net sda_in_n_0_1 [get_bd_pins sda_in_n_0] [get_bd_pins coldata_i2c_0/sda_in_n]
connect_bd_net -net zynq_ultra_ps_e_0_pl_clk0 [get_bd_pins s00_axi_aclk] \
  [get_bd_pins coldata_i2c_0/s00_axi_aclk] [get_bd_pins coldata_i2c_1/s00_axi_aclk]
connect_bd_net -net rst_ps8_0_99M_peripheral_aresetn [get_bd_pins s00_axi_aresetn] \
  [get_bd_pins coldata_i2c_0/s00_axi_aresetn] [get_bd_pins coldata_i2c_1/s00_axi_aresetn]
connect_bd_net [get_bd_pins util_ds_buf_0/OBUF_DS_P] [get_bd_pins scl_p_0]
connect_bd_net [get_bd_pins util_ds_buf_0/OBUF_DS_N] [get_bd_pins scl_n_0]
connect_bd_net [get_bd_pins coldata_i2c_0/scl] [get_bd_pins util_vector_logic_0/Op1]
connect_bd_net [get_bd_pins util_vector_logic_0/Res] [get_bd_pins util_ds_buf_0/OBUF_IN]
connect_bd_net [get_bd_pins coldata_i2c_1/scl] [get_bd_pins util_vector_logic_0/Op2]
connect_bd_net [get_bd_pins coldata_i2c_1/sda_out_p] [get_bd_pins sda_out_p_1]
connect_bd_net [get_bd_pins coldata_i2c_1/sda_out_n] [get_bd_pins sda_out_n_1]
connect_bd_net -net sda_in_p_1_1 [get_bd_pins sda_in_p_1] [get_bd_pins coldata_i2c_1/sda_in_p]
connect_bd_net -net sda_in_n_1_1 [get_bd_pins sda_in_n_1] [get_bd_pins coldata_i2c_1/sda_in_n]

current_bd_instance /coldata_i2c_dual1
connect_bd_intf_net [get_bd_intf_pins S00_AXI1] [get_bd_intf_pins coldata_i2c_1/S00_AXI]
connect_bd_intf_net [get_bd_intf_pins S00_AXI] [get_bd_intf_pins coldata_i2c_0/S00_AXI]
connect_bd_net [get_bd_pins coldata_i2c_0/sda_out_p] [get_bd_pins sda_out_p_0]
connect_bd_net [get_bd_pins coldata_i2c_0/sda_out_n] [get_bd_pins sda_out_n_0]
connect_bd_net -net sda_in_p_0_1 [get_bd_pins sda_in_p_0] [get_bd_pins coldata_i2c_0/sda_in_p]
connect_bd_net -net sda_in_n_0_1 [get_bd_pins sda_in_n_0] [get_bd_pins coldata_i2c_0/sda_in_n]
connect_bd_net -net zynq_ultra_ps_e_0_pl_clk0 [get_bd_pins s00_axi_aclk] \
  [get_bd_pins coldata_i2c_0/s00_axi_aclk] [get_bd_pins coldata_i2c_1/s00_axi_aclk]
connect_bd_net [get_bd_pins util_ds_buf_0/OBUF_DS_P] [get_bd_pins scl_p_0]
connect_bd_net [get_bd_pins util_ds_buf_0/OBUF_DS_N] [get_bd_pins scl_n_0]
connect_bd_net [get_bd_pins coldata_i2c_0/scl] [get_bd_pins util_vector_logic_0/Op1]
connect_bd_net [get_bd_pins util_vector_logic_0/Res] [get_bd_pins util_ds_buf_0/OBUF_IN]
connect_bd_net [get_bd_pins coldata_i2c_1/scl] [get_bd_pins util_vector_logic_0/Op2]
connect_bd_net [get_bd_pins coldata_i2c_1/sda_out_p] [get_bd_pins sda_out_p_1]
connect_bd_net [get_bd_pins coldata_i2c_1/sda_out_n] [get_bd_pins sda_out_n_1]
connect_bd_net -net sda_in_p_1_1 [get_bd_pins sda_in_p_1] [get_bd_pins coldata_i2c_1/sda_in_p]
connect_bd_net -net sda_in_n_1_1 [get_bd_pins sda_in_n_1] [get_bd_pins coldata_i2c_1/sda_in_n]
connect_bd_net [get_bd_pins s00_axi_aresetn] [get_bd_pins coldata_i2c_0/s00_axi_aresetn] [get_bd_pins coldata_i2c_1/s00_axi_aresetn]

current_bd_instance /coldata_i2c_dual2
connect_bd_intf_net [get_bd_intf_pins S00_AXI] [get_bd_intf_pins coldata_i2c_0/S00_AXI]
connect_bd_intf_net [get_bd_intf_pins S00_AXI1] [get_bd_intf_pins coldata_i2c_1/S00_AXI]
connect_bd_net [get_bd_pins coldata_i2c_0/sda_out_p] [get_bd_pins sda_out_p_0]
connect_bd_net [get_bd_pins coldata_i2c_0/sda_out_n] [get_bd_pins sda_out_n_0]
connect_bd_net -net sda_in_p_0_1 [get_bd_pins sda_in_p_0] [get_bd_pins coldata_i2c_0/sda_in_p]
connect_bd_net -net sda_in_n_0_1 [get_bd_pins sda_in_n_0] [get_bd_pins coldata_i2c_0/sda_in_n]
connect_bd_net -net zynq_ultra_ps_e_0_pl_clk0 [get_bd_pins s00_axi_aclk] \
  [get_bd_pins coldata_i2c_0/s00_axi_aclk] [get_bd_pins coldata_i2c_1/s00_axi_aclk]
connect_bd_net [get_bd_pins util_ds_buf_0/OBUF_DS_P] [get_bd_pins scl_p_0]
connect_bd_net [get_bd_pins util_ds_buf_0/OBUF_DS_N] [get_bd_pins scl_n_0]
connect_bd_net [get_bd_pins coldata_i2c_0/scl] [get_bd_pins util_vector_logic_0/Op1]
connect_bd_net [get_bd_pins util_vector_logic_0/Res] [get_bd_pins util_ds_buf_0/OBUF_IN]
connect_bd_net [get_bd_pins coldata_i2c_1/scl] [get_bd_pins util_vector_logic_0/Op2]
connect_bd_net [get_bd_pins coldata_i2c_1/sda_out_p] [get_bd_pins sda_out_p_1]
connect_bd_net [get_bd_pins coldata_i2c_1/sda_out_n] [get_bd_pins sda_out_n_1]
connect_bd_net -net sda_in_p_1_1 [get_bd_pins sda_in_p_1] [get_bd_pins coldata_i2c_1/sda_in_p]
connect_bd_net -net sda_in_n_1_1 [get_bd_pins sda_in_n_1] [get_bd_pins coldata_i2c_1/sda_in_n]
connect_bd_net [get_bd_pins s00_axi_aresetn] [get_bd_pins coldata_i2c_0/s00_axi_aresetn] [get_bd_pins coldata_i2c_1/s00_axi_aresetn]

current_bd_instance /coldata_i2c_dual3
connect_bd_intf_net [get_bd_intf_pins S00_AXI1] [get_bd_intf_pins coldata_i2c_1/S00_AXI]
connect_bd_intf_net [get_bd_intf_pins S00_AXI] [get_bd_intf_pins coldata_i2c_0/S00_AXI]
connect_bd_net [get_bd_pins coldata_i2c_0/sda_out_p] [get_bd_pins sda_out_p_0]
connect_bd_net [get_bd_pins coldata_i2c_0/sda_out_n] [get_bd_pins sda_out_n_0]
connect_bd_net -net sda_in_p_0_1 [get_bd_pins sda_in_p_0] [get_bd_pins coldata_i2c_0/sda_in_p]
connect_bd_net -net sda_in_n_0_1 [get_bd_pins sda_in_n_0] [get_bd_pins coldata_i2c_0/sda_in_n]
connect_bd_net -net zynq_ultra_ps_e_0_pl_clk0 [get_bd_pins s00_axi_aclk] \
  [get_bd_pins coldata_i2c_0/s00_axi_aclk] [get_bd_pins coldata_i2c_1/s00_axi_aclk]
connect_bd_net [get_bd_pins util_ds_buf_0/OBUF_DS_P] [get_bd_pins scl_p_0]
connect_bd_net [get_bd_pins util_ds_buf_0/OBUF_DS_N] [get_bd_pins scl_n_0]
connect_bd_net [get_bd_pins coldata_i2c_0/scl] [get_bd_pins util_vector_logic_0/Op1]
connect_bd_net [get_bd_pins util_vector_logic_0/Res] [get_bd_pins util_ds_buf_0/OBUF_IN]
connect_bd_net [get_bd_pins coldata_i2c_1/scl] [get_bd_pins util_vector_logic_0/Op2]
connect_bd_net [get_bd_pins coldata_i2c_1/sda_out_p] [get_bd_pins sda_out_p_1]
connect_bd_net [get_bd_pins coldata_i2c_1/sda_out_n] [get_bd_pins sda_out_n_1]
connect_bd_net -net sda_in_p_1_1 [get_bd_pins sda_in_p_1] [get_bd_pins coldata_i2c_1/sda_in_p]
connect_bd_net -net sda_in_n_1_1 [get_bd_pins sda_in_n_1] [get_bd_pins coldata_i2c_1/sda_in_n]
connect_bd_net [get_bd_pins s00_axi_aresetn] [get_bd_pins coldata_i2c_0/s00_axi_aresetn] [get_bd_pins coldata_i2c_1/s00_axi_aresetn]

current_bd_instance /dbg
connect_bd_intf_net [get_bd_intf_pins debug_bridge_0/m0_bscan] [get_bd_intf_pins debug_bridge_1/S_BSCAN]
connect_bd_intf_net [get_bd_intf_pins S_AXI] [get_bd_intf_pins debug_bridge_0/S_AXI]
connect_bd_net -net zynq_ultra_ps_e_0_pl_clk0 [get_bd_pins AXI_CLK_OUT] [get_bd_pins debug_bridge_0/s_axi_aclk] [get_bd_pins debug_bridge_1/clk]
connect_bd_net -net rst_ps8_0_99M_peripheral_aresetn [get_bd_pins AXI_RSTn] [get_bd_pins debug_bridge_0/s_axi_aresetn]

current_bd_instance /daq_spy_0
connect_bd_intf_net [get_bd_intf_pins axi_bram_ctrl_0_bram/BRAM_PORTA] [get_bd_intf_pins axi_bram_ctrl_0/BRAM_PORTA]
connect_bd_intf_net [get_bd_intf_pins S_AXI] [get_bd_intf_pins axi_bram_ctrl_0/S_AXI]
connect_bd_net [get_bd_pins daq_spy_control_0/bram_addr] [get_bd_pins axi_bram_ctrl_0_bram/addrb] [get_bd_pins ila_0/probe2]
connect_bd_net [get_bd_pins daq_spy_control_0/bram_clk] [get_bd_pins axi_bram_ctrl_0_bram/clkb]
connect_bd_net [get_bd_pins daq_spy_control_0/bram_din] [get_bd_pins axi_bram_ctrl_0_bram/dinb] [get_bd_pins ila_0/probe3]
connect_bd_net [get_bd_pins daq_spy_control_0/bram_en] [get_bd_pins axi_bram_ctrl_0_bram/enb] [get_bd_pins ila_0/probe4]
connect_bd_net [get_bd_pins daq_spy_control_0/bram_rst] [get_bd_pins axi_bram_ctrl_0_bram/rstb]
connect_bd_net [get_bd_pins daq_spy_control_0/bram_we] [get_bd_pins axi_bram_ctrl_0_bram/web] [get_bd_pins ila_0/probe5]
connect_bd_net -net zynq_ultra_ps_e_0_pl_clk0 [get_bd_pins AXI_CLK_OUT] [get_bd_pins axi_bram_ctrl_0/s_axi_aclk]
connect_bd_net -net rst_ps8_0_99M_peripheral_aresetn [get_bd_pins AXI_RSTn] [get_bd_pins axi_bram_ctrl_0/s_axi_aresetn]
connect_bd_net -net daq_stream0_0_1 [get_bd_pins daq_stream0] [get_bd_pins daq_spy_control_0/daq_stream] [get_bd_pins ila_0/probe0]
connect_bd_net -net daq_stream_k0_0_1 [get_bd_pins daq_stream_k0] [get_bd_pins daq_spy_control_0/daq_stream_k] [get_bd_pins ila_0/probe1]
connect_bd_net -net daq_clk_0_1 [get_bd_pins daq_clk] [get_bd_pins daq_spy_control_0/daq_clk] [get_bd_pins ila_0/clk]
connect_bd_net -net pdts_endpoint_0_tstamp [get_bd_pins ts_tstamp] [get_bd_pins daq_spy_control_0/time_stamp]
connect_bd_net -net pdts_endpoint_0_clk [get_bd_pins ts_clk] [get_bd_pins daq_spy_control_0/clk65p5]
connect_bd_net -net reset_0_1 [get_bd_pins daq_spy_reset] [get_bd_pins daq_spy_control_0/reset]
connect_bd_net -net daq_spy_full_0 [get_bd_pins daq_spy_control_0/full] [get_bd_pins daq_spy_full] [get_bd_pins ila_0/probe6]
connect_bd_net [get_bd_pins daq_spy_control_0/state] [get_bd_pins ila_0/probe7]

current_bd_instance /daq_spy_1
connect_bd_intf_net [get_bd_intf_pins axi_bram_ctrl_0_bram/BRAM_PORTA] [get_bd_intf_pins axi_bram_ctrl_0/BRAM_PORTA]
connect_bd_intf_net [get_bd_intf_pins S_AXI] [get_bd_intf_pins axi_bram_ctrl_0/S_AXI]
connect_bd_net [get_bd_pins daq_spy_control_0/bram_addr] [get_bd_pins axi_bram_ctrl_0_bram/addrb]
connect_bd_net [get_bd_pins daq_spy_control_0/bram_clk] [get_bd_pins axi_bram_ctrl_0_bram/clkb]
connect_bd_net [get_bd_pins daq_spy_control_0/bram_din] [get_bd_pins axi_bram_ctrl_0_bram/dinb]
connect_bd_net [get_bd_pins daq_spy_control_0/bram_en] [get_bd_pins axi_bram_ctrl_0_bram/enb]
connect_bd_net [get_bd_pins daq_spy_control_0/bram_rst] [get_bd_pins axi_bram_ctrl_0_bram/rstb]
connect_bd_net [get_bd_pins daq_spy_control_0/bram_we] [get_bd_pins axi_bram_ctrl_0_bram/web]
connect_bd_net -net zynq_ultra_ps_e_0_pl_clk0 [get_bd_pins AXI_CLK_OUT] [get_bd_pins axi_bram_ctrl_0/s_axi_aclk]
connect_bd_net -net daq_stream0_0_1 [get_bd_pins daq_stream0] [get_bd_pins daq_spy_control_0/daq_stream]
connect_bd_net -net daq_stream_k0_0_1 [get_bd_pins daq_stream_k0] [get_bd_pins daq_spy_control_0/daq_stream_k]
connect_bd_net -net daq_clk_0_1 [get_bd_pins daq_clk] [get_bd_pins daq_spy_control_0/daq_clk]
connect_bd_net -net pdts_endpoint_0_tstamp [get_bd_pins ts_tstamp] [get_bd_pins daq_spy_control_0/time_stamp]
connect_bd_net -net pdts_endpoint_0_clk [get_bd_pins ts_clk] [get_bd_pins daq_spy_control_0/clk65p5]
connect_bd_net -net reset_0_1 [get_bd_pins daq_spy_reset] [get_bd_pins daq_spy_control_0/reset]
connect_bd_net -net daq_spy_full_0 [get_bd_pins daq_spy_control_0/full] [get_bd_pins daq_spy_full]
connect_bd_net [get_bd_pins AXI_RSTn] [get_bd_pins axi_bram_ctrl_0/s_axi_aresetn]

current_bd_instance /
connect_bd_intf_net [get_bd_intf_pins ps8_0_axi_periph/M01_AXI] [get_bd_intf_pins coldata_i2c_dual0/S00_AXI]
connect_bd_intf_net [get_bd_intf_pins ps8_0_axi_periph/M14_AXI] [get_bd_intf_pins dbg/S_AXI]
connect_bd_intf_net -intf_net S00_AXI1_2 [get_bd_intf_pins coldata_i2c_dual2/S00_AXI1] [get_bd_intf_pins ps8_0_axi_periph/M08_AXI]
connect_bd_intf_net [get_bd_intf_pins coldata_i2c_dual2/S00_AXI] [get_bd_intf_pins ps8_0_axi_periph/M07_AXI]
connect_bd_intf_net [get_bd_intf_pins ps8_0_axi_periph/M11_AXI] [get_bd_intf_pins axi_iic_0/S_AXI]
connect_bd_intf_net [get_bd_intf_pins ps8_0_axi_periph/M13_AXI] [get_bd_intf_pins axi_gpio_1/S_AXI]
connect_bd_intf_net -intf_net S00_AXI1_3 [get_bd_intf_pins coldata_i2c_dual3/S00_AXI1] [get_bd_intf_pins ps8_0_axi_periph/M10_AXI]
connect_bd_intf_net [get_bd_intf_pins ps8_0_axi_periph/M04_AXI] [get_bd_intf_pins coldata_i2c_dual0/S00_AXI1]
connect_bd_intf_net [get_bd_intf_pins reg_bank_64_0/S00_AXI] [get_bd_intf_pins ps8_0_axi_periph/M12_AXI]
connect_bd_intf_net [get_bd_intf_pins ps8_0_axi_periph/M00_AXI] [get_bd_intf_pins daq_spy_0/S_AXI]
connect_bd_intf_net [get_bd_intf_pins coldata_i2c_dual1/S00_AXI] [get_bd_intf_pins ps8_0_axi_periph/M05_AXI]
connect_bd_intf_net [get_bd_intf_ports iic_rtl_0] [get_bd_intf_pins axi_iic_0/IIC]
connect_bd_intf_net [get_bd_intf_pins ps8_0_axi_periph/M03_AXI] [get_bd_intf_pins coldata_fast_cmd_0/S00_AXI]
connect_bd_intf_net [get_bd_intf_ports WIB_LED] [get_bd_intf_pins axi_gpio_1/GPIO]
connect_bd_intf_net [get_bd_intf_pins ps8_0_axi_periph/M15_AXI] [get_bd_intf_pins daq_spy_1/S_AXI]
connect_bd_intf_net [get_bd_intf_pins coldata_i2c_dual3/S00_AXI] [get_bd_intf_pins ps8_0_axi_periph/M09_AXI]
connect_bd_intf_net -intf_net S00_AXI1_1 [get_bd_intf_pins coldata_i2c_dual1/S00_AXI1] [get_bd_intf_pins ps8_0_axi_periph/M06_AXI]
connect_bd_intf_net [get_bd_intf_pins zynq_ultra_ps_e_0/M_AXI_HPM0_FPD] [get_bd_intf_pins ps8_0_axi_periph/S00_AXI]
connect_bd_net [get_bd_pins zynq_ultra_ps_e_0/pl_clk0] \
  [get_bd_pins timing_module/sclk] [get_bd_pins coldata_i2c_dual0/s00_axi_aclk] [get_bd_pins coldata_i2c_dual1/s00_axi_aclk] \
  [get_bd_pins coldata_i2c_dual2/s00_axi_aclk] [get_bd_pins coldata_i2c_dual3/s00_axi_aclk] [get_bd_ports AXI_CLK_OUT] \
  [get_bd_pins dbg/AXI_CLK_OUT] [get_bd_pins daq_spy_0/AXI_CLK_OUT] [get_bd_pins daq_spy_1/AXI_CLK_OUT] \
  [get_bd_pins axi_gpio_1/s_axi_aclk] [get_bd_pins axi_iic_0/s_axi_aclk] [get_bd_pins coldata_fast_cmd_0/s00_axi_aclk] \
  [get_bd_pins ps8_0_axi_periph/ACLK] [get_bd_pins ps8_0_axi_periph/S00_ACLK] [get_bd_pins ps8_0_axi_periph/M00_ACLK] \
  [get_bd_pins ps8_0_axi_periph/M01_ACLK] [get_bd_pins ps8_0_axi_periph/M02_ACLK] [get_bd_pins ps8_0_axi_periph/M03_ACLK] \
  [get_bd_pins ps8_0_axi_periph/M04_ACLK] [get_bd_pins ps8_0_axi_periph/M05_ACLK] [get_bd_pins ps8_0_axi_periph/M06_ACLK] \
  [get_bd_pins ps8_0_axi_periph/M07_ACLK] [get_bd_pins ps8_0_axi_periph/M08_ACLK] [get_bd_pins ps8_0_axi_periph/M09_ACLK] \
  [get_bd_pins ps8_0_axi_periph/M10_ACLK] [get_bd_pins ps8_0_axi_periph/M11_ACLK] [get_bd_pins ps8_0_axi_periph/M12_ACLK] \
  [get_bd_pins ps8_0_axi_periph/M13_ACLK] [get_bd_pins ps8_0_axi_periph/M14_ACLK] [get_bd_pins ps8_0_axi_periph/M15_ACLK] \
  [get_bd_pins reg_bank_64_0/s00_axi_aclk] [get_bd_pins rst_ps8_0_99M/slowest_sync_clk] \
  [get_bd_pins zynq_ultra_ps_e_0/maxihpm0_fpd_aclk]
connect_bd_net [get_bd_pins zynq_ultra_ps_e_0/pl_resetn0] [get_bd_pins rst_ps8_0_99M/ext_reset_in]
connect_bd_net [get_bd_pins rst_ps8_0_99M/peripheral_aresetn] \
  [get_bd_pins coldata_i2c_dual0/s00_axi_aresetn] [get_bd_pins coldata_i2c_dual1/s00_axi_aresetn] \
  [get_bd_pins coldata_i2c_dual2/s00_axi_aresetn] [get_bd_pins coldata_i2c_dual3/s00_axi_aresetn] [get_bd_ports AXI_RSTn] \
  [get_bd_pins dbg/AXI_RSTn] [get_bd_pins daq_spy_0/AXI_RSTn] [get_bd_pins daq_spy_1/AXI_RSTn] \
  [get_bd_pins axi_gpio_1/s_axi_aresetn] [get_bd_pins axi_iic_0/s_axi_aresetn] \
  [get_bd_pins coldata_fast_cmd_0/s00_axi_aresetn] [get_bd_pins ps8_0_axi_periph/S00_ARESETN] \
  [get_bd_pins ps8_0_axi_periph/M00_ARESETN] [get_bd_pins ps8_0_axi_periph/M01_ARESETN] \
  [get_bd_pins ps8_0_axi_periph/M02_ARESETN] [get_bd_pins ps8_0_axi_periph/M03_ARESETN] \
  [get_bd_pins ps8_0_axi_periph/M04_ARESETN] [get_bd_pins ps8_0_axi_periph/M05_ARESETN] \
  [get_bd_pins ps8_0_axi_periph/M06_ARESETN] [get_bd_pins ps8_0_axi_periph/M07_ARESETN] \
  [get_bd_pins ps8_0_axi_periph/M08_ARESETN] [get_bd_pins ps8_0_axi_periph/M09_ARESETN] \
  [get_bd_pins ps8_0_axi_periph/M10_ARESETN] [get_bd_pins ps8_0_axi_periph/M11_ARESETN] \
  [get_bd_pins ps8_0_axi_periph/M12_ARESETN] [get_bd_pins ps8_0_axi_periph/M13_ARESETN] \
  [get_bd_pins ps8_0_axi_periph/M14_ARESETN] [get_bd_pins ps8_0_axi_periph/M15_ARESETN] \
  [get_bd_pins reg_bank_64_0/s00_axi_aresetn]
connect_bd_net [get_bd_pins rst_ps8_0_99M/interconnect_aresetn] [get_bd_pins ps8_0_axi_periph/ARESETN]
connect_bd_net -net coldata_i2c_0_scl_p [get_bd_pins coldata_i2c_dual0/scl_p_0] [get_bd_ports scl_p_0]
connect_bd_net -net coldata_i2c_0_scl_n [get_bd_pins coldata_i2c_dual0/scl_n_0] [get_bd_ports scl_n_0]
connect_bd_net -net coldata_i2c_0_sda_out_p [get_bd_pins coldata_i2c_dual0/sda_out_p_0] [get_bd_ports sda_out_p_0]
connect_bd_net -net coldata_i2c_0_sda_out_n [get_bd_pins coldata_i2c_dual0/sda_out_n_0] [get_bd_ports sda_out_n_0]
connect_bd_net -net sda_in_p_0_1 [get_bd_ports sda_in_p_0] [get_bd_pins coldata_i2c_dual0/sda_in_p_0]
connect_bd_net -net sda_in_n_0_1 [get_bd_ports sda_in_n_0] [get_bd_pins coldata_i2c_dual0/sda_in_n_0]
connect_bd_net [get_bd_pins coldata_fast_cmd_0/fastcommand_out_p] [get_bd_ports fastcommand_out_p_0]
connect_bd_net [get_bd_pins coldata_fast_cmd_0/fastcommand_out_n] [get_bd_ports fastcommand_out_n_0]
connect_bd_net -net rec_d_clk_0_1 [get_bd_ports ts_rec_d_clk] [get_bd_pins timing_module/ts_rec_d_clk]
connect_bd_net -net rec_d_0_1 [get_bd_ports ts_rec_d] [get_bd_pins timing_module/ts_rec_d]
connect_bd_net -net rec_clk_locked_0_1 [get_bd_ports ts_rec_clk_locked] [get_bd_pins timing_module/ts_rec_clk_locked]
connect_bd_net -net sfp_los_0_1 [get_bd_ports ts_sfp_los] [get_bd_pins timing_module/ts_sfp_los]
connect_bd_net -net cdr_los_0_1 [get_bd_ports ts_cdr_los] [get_bd_pins timing_module/ts_cdr_los]
connect_bd_net -net cdr_lol_0_1 [get_bd_ports ts_cdr_lol] [get_bd_pins timing_module/ts_cdr_lol]
connect_bd_net -net pdts_endpoint_0_clk [get_bd_pins timing_module/ts_clk] \
  [get_bd_ports ts_clk] [get_bd_pins daq_spy_0/ts_clk] [get_bd_pins daq_spy_1/ts_clk] \
  [get_bd_pins coldata_fast_cmd_0/clk62p5]
connect_bd_net -net pdts_endpoint_0_rst [get_bd_pins timing_module/ts_rst] [get_bd_ports ts_rst]
connect_bd_net -net pdts_endpoint_0_rdy [get_bd_pins timing_module/ts_rdy] [get_bd_ports ts_rdy]
connect_bd_net -net pdts_endpoint_0_sync [get_bd_pins timing_module/ts_sync] [get_bd_ports ts_sync]
connect_bd_net -net pdts_endpoint_0_sync_v [get_bd_pins timing_module/ts_sync_v] [get_bd_ports ts_sync_v]
connect_bd_net -net pdts_endpoint_0_tstamp [get_bd_pins timing_module/ts_tstamp] \
  [get_bd_ports ts_tstamp] [get_bd_pins daq_spy_0/ts_tstamp] [get_bd_pins daq_spy_1/ts_tstamp]
connect_bd_net -net pdts_endpoint_0_evtctr [get_bd_pins timing_module/ts_evtctr] [get_bd_ports ts_evtctr]
connect_bd_net -net coldata_i2c_dual_sda_out_p_1 [get_bd_pins coldata_i2c_dual0/sda_out_p_1] [get_bd_ports sda_out_p_1]
connect_bd_net -net coldata_i2c_dual_sda_out_n_1 [get_bd_pins coldata_i2c_dual0/sda_out_n_1] [get_bd_ports sda_out_n_1]
connect_bd_net -net sda_in_p_1_1 [get_bd_ports sda_in_p_1] [get_bd_pins coldata_i2c_dual0/sda_in_p_1]
connect_bd_net -net sda_in_n_1_1 [get_bd_ports sda_in_n_1] [get_bd_pins coldata_i2c_dual0/sda_in_n_1]
connect_bd_net [get_bd_pins coldata_i2c_dual1/sda_out_p_0] [get_bd_ports sda_out_p_2]
connect_bd_net [get_bd_pins coldata_i2c_dual1/sda_out_n_0] [get_bd_ports sda_out_n_2]
